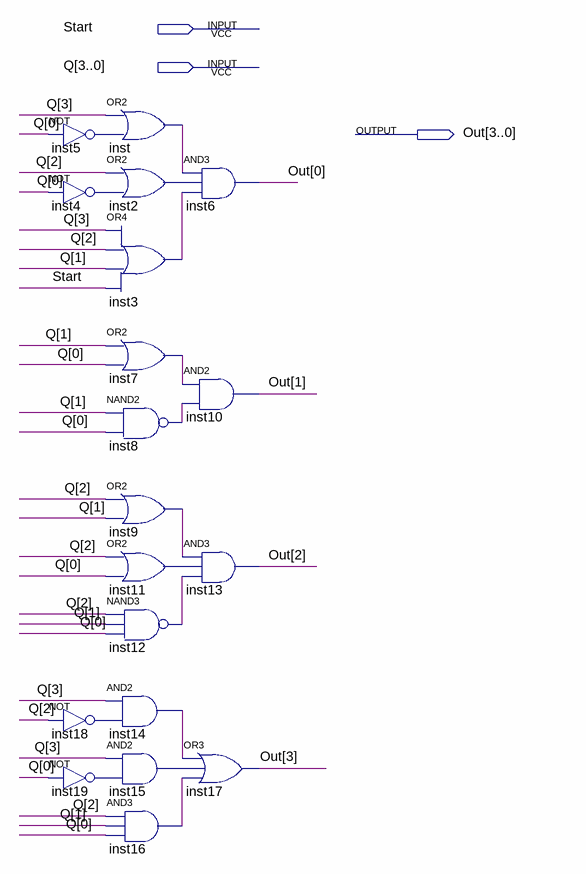
[diagram p0: schematic sheet]
// Quartus schematic nextstate_14state.bdf as structural Verilog: 19 symbols, 3 pins
module nextstate_14state (
  input  Start,
  input  [3:0] Q,
  output [3:0] Out
);

  wire inst2_out, inst3_out, inst4_out, inst5_out, inst7_out, inst8_out, inst9_out, inst11_out, inst12_out,
       inst14_out, inst15_out, inst16_out, inst18_out, inst19_out, inst_out;

  not inst5 (inst5_out, Q[0]);
  not inst4 (inst4_out, Q[0]);
  not inst18 (inst18_out, Q[2]);
  not inst19 (inst19_out, Q[0]);
  or inst (inst_out, Q[3], inst5_out);
  or inst2 (inst2_out, Q[2], inst4_out);
  or inst3 (inst3_out, Q[3], Q[2], Q[1], Start);
  or inst7 (inst7_out, Q[1], Q[0]);
  nand inst8 (inst8_out, Q[1], Q[0]);
  or inst9 (inst9_out, Q[2], Q[1]);
  or inst11 (inst11_out, Q[2], Q[0]);
  nand inst12 (inst12_out, Q[2], Q[1], Q[0]);
  and inst14 (inst14_out, Q[3], inst18_out);
  and inst15 (inst15_out, Q[3], inst19_out);
  and inst16 (inst16_out, Q[2], Q[1], Q[0]);
  and inst6 (Out[0], inst_out, inst2_out, inst3_out);
  and inst10 (Out[1], inst7_out, inst8_out);
  and inst13 (Out[2], inst9_out, inst11_out, inst12_out);
  or inst17 (Out[3], inst14_out, inst15_out, inst16_out);
endmodule
